# EasyEDA Pro project Macropad-Advanced.eprj

# Schematic Schematic1
Board Name: Board1; Create Date: 2025-08-17; Page Name: P1; Project Name: Macropad-Advanced; Schematic Name: Schematic1; Update Date: 2025-08-25; Company: EasyEDA.com; Page Size: A4; Version: V1.0
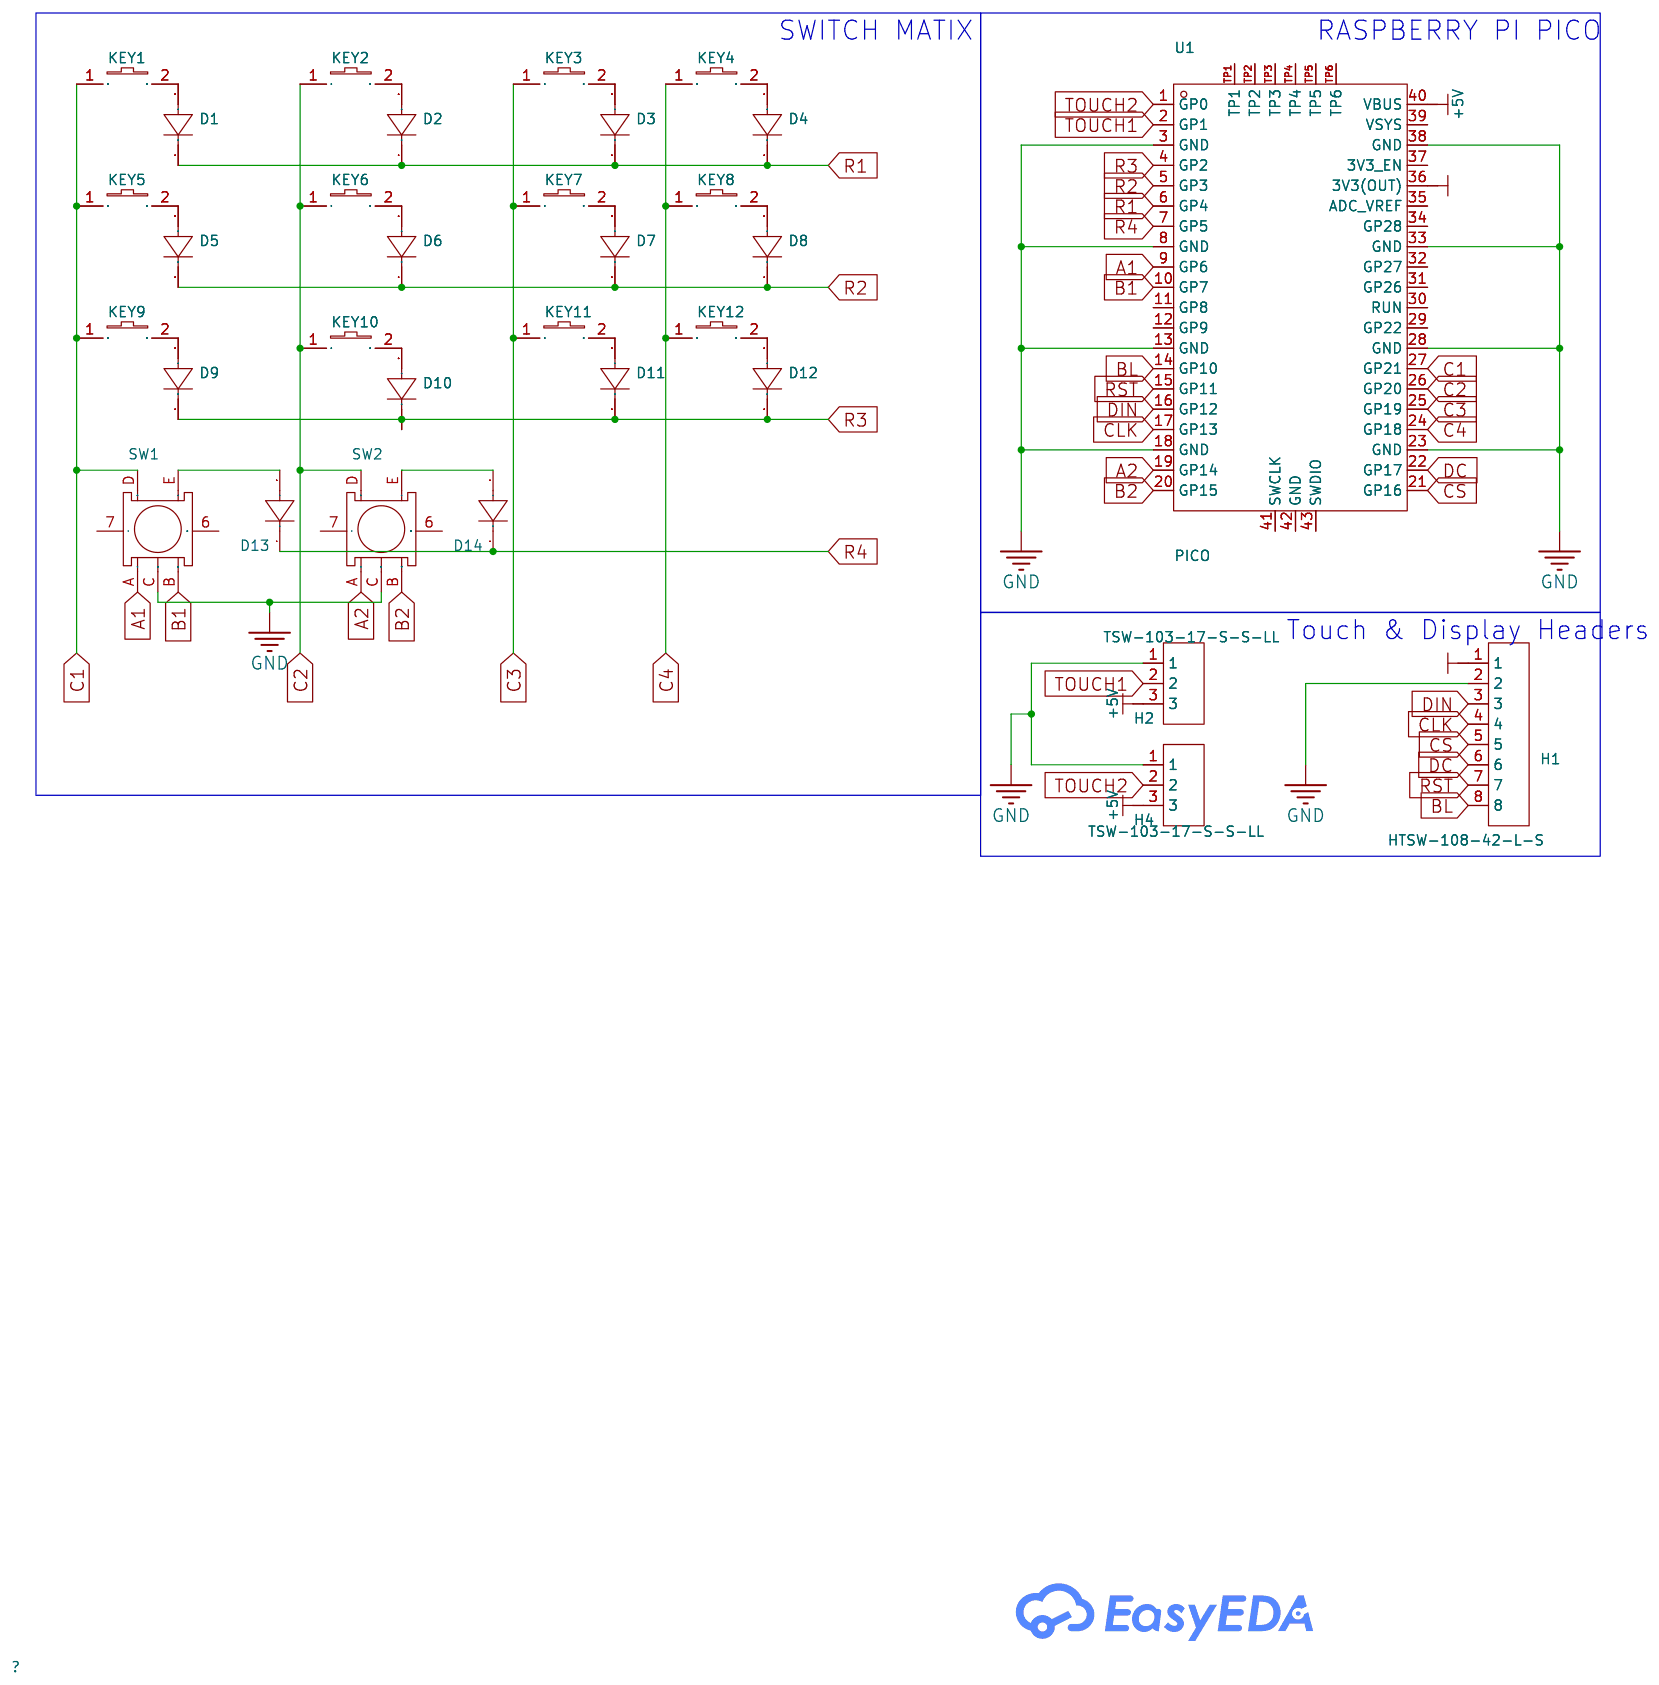
[diagram p0: schematic sheet]

## Parts
D1  -  [DO-35_BD2.0-L4.0-P8.00-D0.5-FD]
D2  -  [DO-35_BD2.0-L4.0-P8.00-D0.5-FD]
D3  -  [DO-35_BD2.0-L4.0-P8.00-D0.5-FD]
D4  -  [DO-35_BD2.0-L4.0-P8.00-D0.5-FD]
D5  -  [DO-35_BD2.0-L4.0-P8.00-D0.5-FD]
D6  -  [DO-35_BD2.0-L4.0-P8.00-D0.5-FD]
D7  -  [DO-35_BD2.0-L4.0-P8.00-D0.5-FD]
D8  -  [DO-35_BD2.0-L4.0-P8.00-D0.5-FD]
D9  -  [DO-35_BD2.0-L4.0-P8.00-D0.5-FD]
D10  -  [DO-35_BD2.0-L4.0-P8.00-D0.5-FD]
D11  -  [DO-35_BD2.0-L4.0-P8.00-D0.5-FD]
D12  -  [DO-35_BD2.0-L4.0-P8.00-D0.5-FD]
D13  -  [DO-35_BD2.0-L4.0-P8.00-D0.5-FD]
D14  -  [DO-35_BD2.0-L4.0-P8.00-D0.5-FD]
H1  HTSW-108-42-L-S  [HDR-TH_8P-P2.54-V-M]
H2  TSW-103-17-S-S-LL  [HDR-TH_3P-P2.54-V-M_HTSW-103-07-F-S]
H4  TSW-103-17-S-S-LL  [HDR-TH_3P-P2.54-V-M_HTSW-103-07-F-S]
KEY1  28115182DM  [MX_PCB_1.00u]
KEY2  28115182DM  [MX_PCB_1.00u]
KEY3  28115182DM  [MX_PCB_1.00u]
KEY4  28115182DM  [MX_PCB_1.00u]
KEY5  28115182DM  [MX_PCB_1.00u]
KEY6  28115182DM  [MX_PCB_1.00u]
KEY7  28115182DM  [MX_PCB_1.00u]
KEY8  28115182DM  [MX_PCB_1.00u]
KEY9  28115182DM  [MX_PCB_1.00u]
KEY10  28115182DM  [MX_PCB_1.00u]
KEY11  28115182DM  [MX_PCB_1.00u]
KEY12  28115182DM  [MX_PCB_1.00u]
SW1  EC11E09244BS  [SW-TH_EC11XXXXXXXX]
SW2  EC11E09244BS  [SW-TH_EC11XXXXXXXX]
U1  PICO  [Raspberry_Pi_Pico]

## Library data of the parts
D1-D14 = 1N4148: Diode Configuration: Power Dissipation: Reverse Voltage (Vr): Average Rectified Current (Io): Forward Voltage (Vf@If):1V@10mA Reverse Leakage Current:5μA@75V Reverse Recovery Time (trr): Operating Temperature:+200℃@(Tj) Operating Temperature:+200℃@(Tj); LCSC Part Name: 75V 200mA 4ns; Supplier Part: C14516; Manufacturer: ST(先科); Supplier Footprint: DO-35; JLCPCB Part Class: Extended Part; Datasheet: https://atta.szlcsc.com/upload/public/pdf/source/20140303/1457707004955.pdf; Supplier: LCSC; Forward Voltage (Vf@If): 1V@10mA; Reverse Leakage Current: 5μA@75V; Operating Temperature: +200℃@(Tj)
H1 = HTSW-108-42-L-S: LCSC Part Name: 间距:2.54mm 直插; Supplier Part: C6055184; Manufacturer: SAMTEC; Supplier Footprint: 插件,P=2.54mm; JLCPCB Part Class: Extended Part; Datasheet: https://item.szlcsc.com/datasheet/HTSW-108-42-L-S/6994319.html; Supplier: LCSC; Pitch: 2.54mm; Mounting Type: Through Hole; Number of Rows: 1; Number of Pins: 8P; Contact Material: Phosphor Bronze; Contact Plating: Tin; Operating Temperature: -55℃~+125℃
H2 H4 = TSW-103-17-S-S-LL: LCSC Part Name: 间距:2.54mm 直插; Supplier Part: C6339710; Manufacturer: SAMTEC; Supplier Footprint: 插件,P=2.54mm; JLCPCB Part Class: Extended Part; Datasheet: https://item.szlcsc.com/datasheet/TSW-103-17-S-S-LL/7288409.html; Supplier: LCSC; Pitch: 2.54mm; Mounting Type: Through Hole; Number of Rows: 1; Number of Pins: 3P; Contact Material: Phosphor Bronze; Contact Plating: Tin; Operating Temperature: -55℃~+125℃; Color: Black
KEY1-KEY12 = 28115182DM: Axis Type:水晶轴 Number of Pins:2 Life:5000万次 Operation Force:60gf Conduction Travel:- Voltage Rating:- Operating Temperature:-10℃~+70℃ Operating Temperature:-10℃~+70℃; Supplier Part: C47121945; Manufacturer: SAMZO(三佐); Supplier Footprint: 插件; JLCPCB Part Class: Extended Part; Datasheet: https://atta.szlcsc.com/upload/public/pdf/source/20250402/8399631E7C857A557AEE3DBE24222DC8.pdf; Supplier: LCSC; Axis Type: 水晶轴; Number of Pins: 2; Life: 5000万次; Operation Force: 60gf; Operating Temperature: -10℃~+70℃
SW1 SW2 = EC11E09244BS: Supplier Part: C470742; Manufacturer: ALPSALPINE(阿尔卑斯阿尔派); Supplier Footprint: 插件; JLCPCB Part Class: Extended Part; Datasheet: https://atta.szlcsc.com/upload/public/pdf/source/20191216/C470795_DE763ECE59BD49533DB26DB53E5D34B2.pdf; Supplier: LCSC
U1 = PICO: Supplier Part: C7203002; Manufacturer: Raspberry Pi(树莓派); Datasheet: https://atta.szlcsc.com/upload/public/pdf/source/20230906/086376002DDC9866828648BC93E51F8B.pdf; Supplier: LCSC

## Nets
3V3: H1.1 U1.36(3V3(OUT))
+5V: H2.3 H4.3 U1.40(VBUS)
GND: H1.2 H2.1 H4.1 SW1.C SW2.C U1.3(GND) U1.8(GND) U1.13(GND) U1.18(GND) U1.23(GND) U1.28(GND) U1.33(GND) U1.38(GND)
A1: SW1.A U1.9(GP6)
A2: SW2.A U1.19(GP14)
B1: SW1.B U1.10(GP7)
B2: SW2.B U1.20(GP15)
BL: H1.8 U1.14(GP10)
C1: KEY1.1 KEY5.1 KEY9.1 SW1.D U1.27(GP21)
C2: KEY2.1 KEY6.1 KEY10.1 SW2.D U1.26(GP20)
C3: KEY3.1 KEY7.1 KEY11.1 U1.25(GP19)
C4: KEY4.1 KEY8.1 KEY12.1 U1.24(GP18)
CLK: H1.4 U1.17(GP13)
CS: H1.5 U1.21(GP16)
DC: H1.6 U1.22(GP17)
DIN: H1.3 U1.16(GP12)
R1: D1.1(K) D2.1(K) D3.1(K) D4.1(K) U1.6(GP4)
R2: D5.1(K) D6.1(K) D7.1(K) D8.1(K) U1.5(GP3)
R3: D9.1(K) D10.1(K) D11.1(K) D12.1(K) U1.4(GP2)
R4: D13.1(K) D14.1(K) U1.7(GP5)
RST: H1.7 U1.15(GP11)
TOUCH1: H2.2 U1.2(GP1)
TOUCH2: H4.2 U1.1(GP0)
$1N1027: D3.2(A) KEY3.2
$1N4546: D4.2(A) KEY4.2
$1N4608: D5.2(A) KEY5.2
$1N4671: D6.2(A) KEY6.2
$1N4735: D7.2(A) KEY7.2
$1N4798: D8.2(A) KEY8.2
$1N4860: D9.2(A) KEY9.2
$1N5043: D10.2(A) KEY10.2
$1N5045: D11.2(A) KEY11.2
$1N5047: D12.2(A) KEY12.2
$1N9257: D2.2(A) KEY2.2
$1N9289: D13.2(A) SW1.E
$1N9294: D14.2(A) SW2.E
$1N13677: D1.2(A) KEY1.2

Not connected (* = marked no-connect by the designer): SW1 6 7; SW2 6 7; U1 11(GP8) 12(GP9) 29(GP22) 30(RUN) 31(GP26) 32(GP27) 34(GP28) 35(ADC_VREF) 37(3V3_EN) 39(VSYS) 41(SWCLK) 42(GND) 43(SWDIO) TP1 TP2 TP3 TP4 TP5 TP6

## Notes on the sheet
- SWITCH MATIX
- RASPBERRY PI PICO
- Touch & Display Headers

# Board PCB1
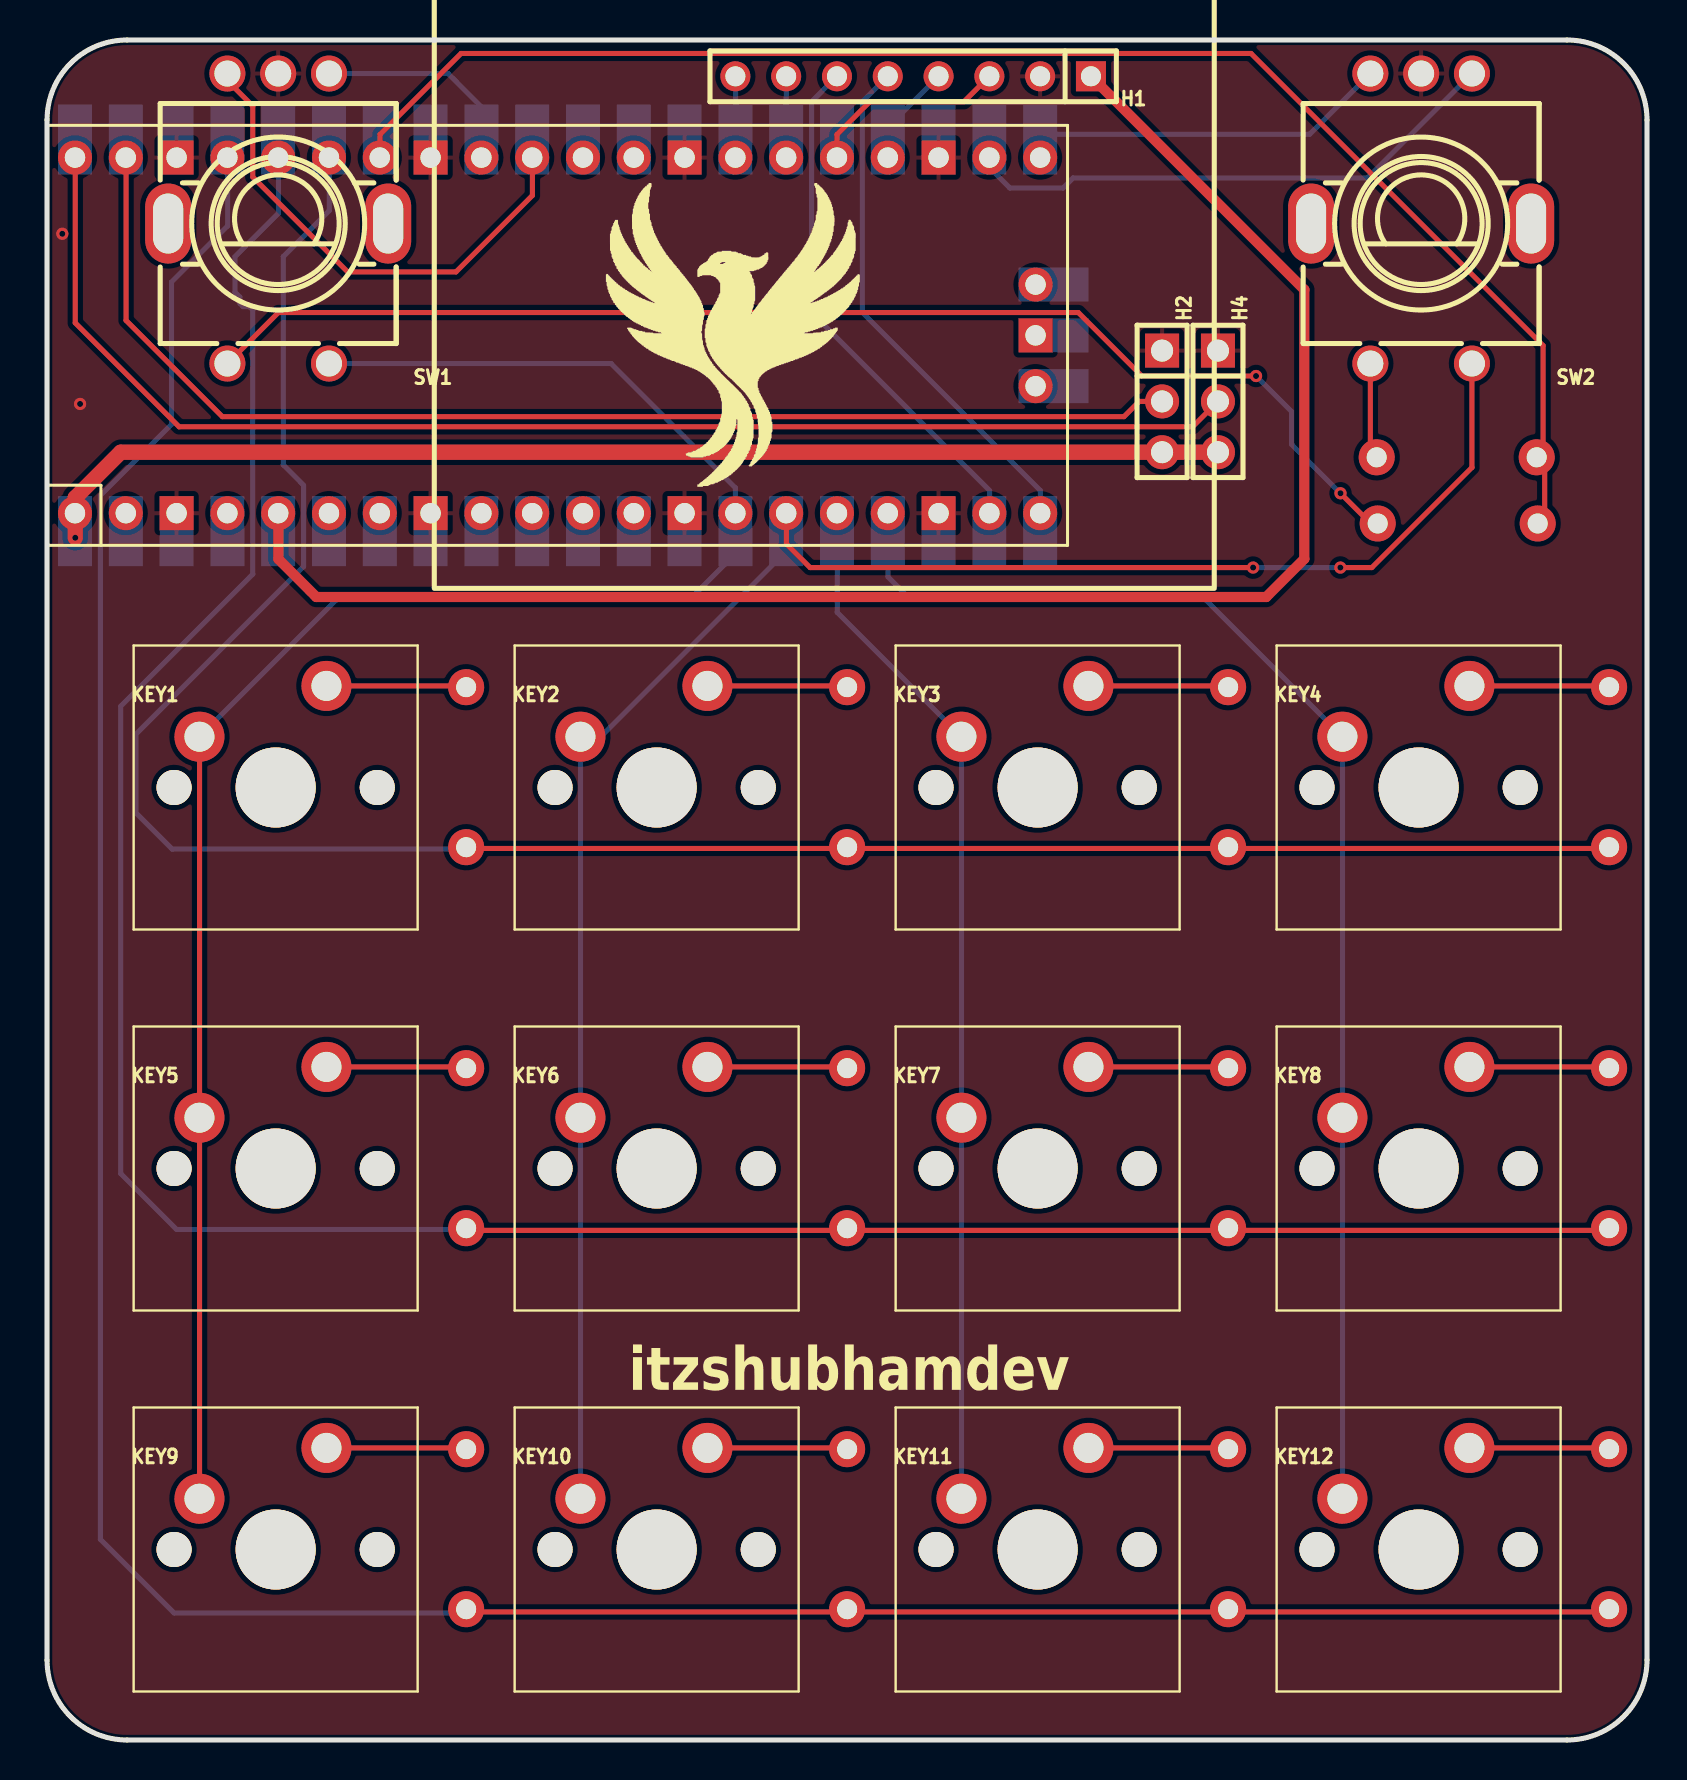
[diagram p1: board, top side]
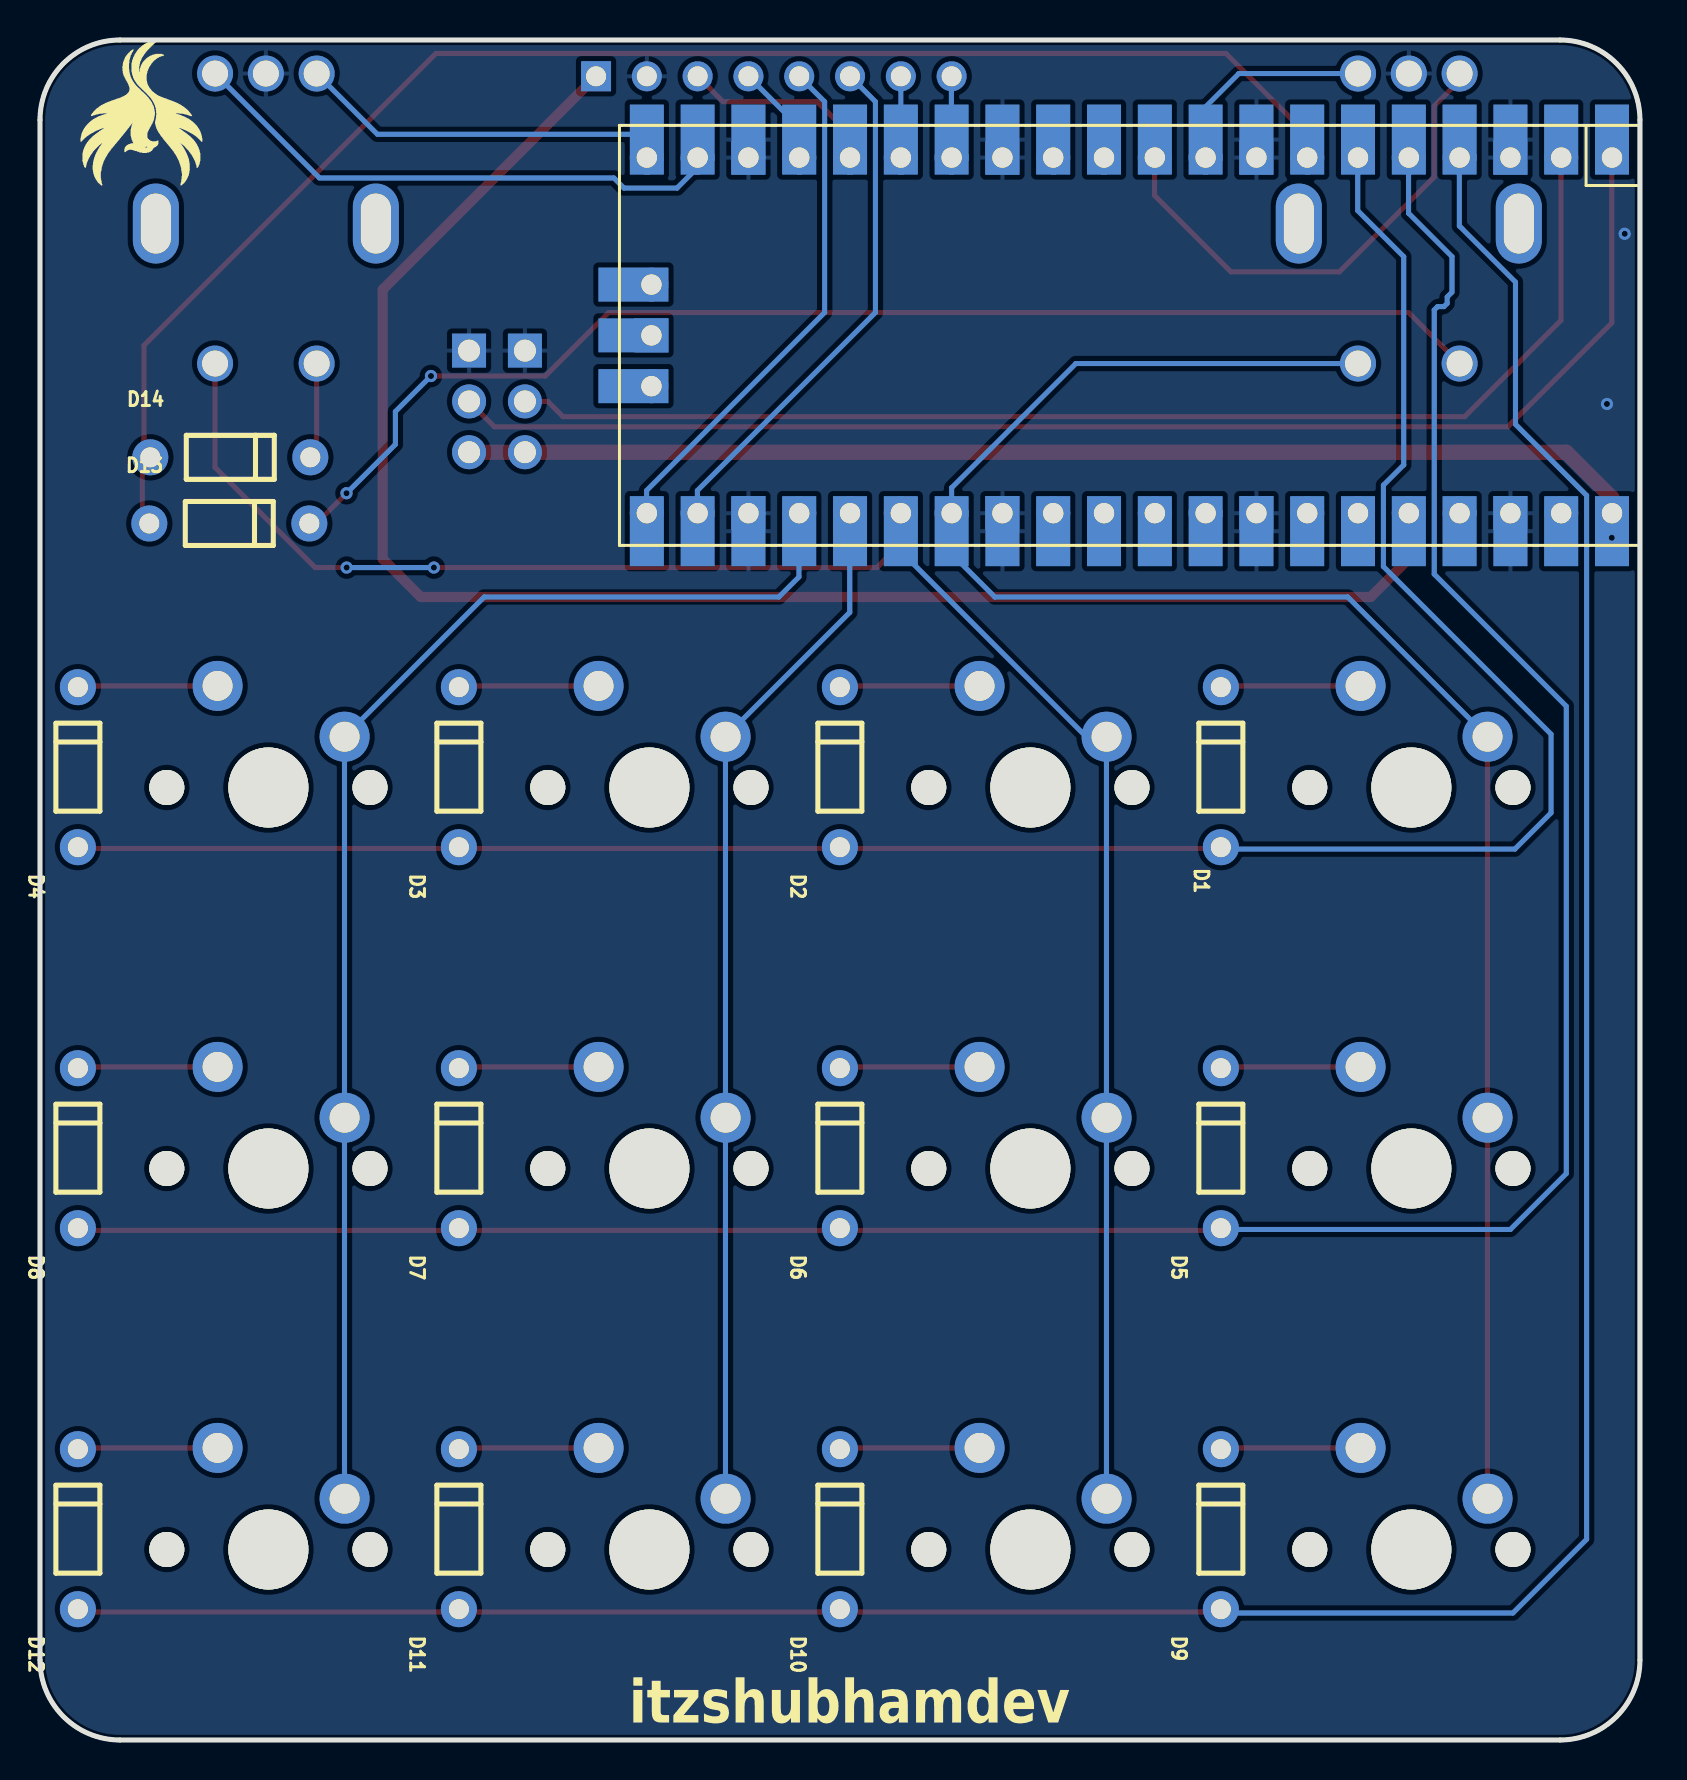
[diagram p2: board, bottom side, seen from below]

Outline 80 x 85 mm; copper layers: Top Layer, Bottom Layer. Coordinates in mm from the lower left corner of the outline.
Outline path: 0,81 0,4 arc(1.17,1.17) 4,0 76,0 arc(78.83,1.17) 80,4 80,81 arc(78.83,83.83) 76,85 4,85 arc(1.17,83.83) 0,81
Stack: Top Layer 0.035mm / Dielectric1 1.51mm FR4 er 4.5 / Bottom Layer 0.035mm

## Design rules (mm)
template: JLCPCB Capability(Two Layers Board)
spacing copperThickness1oz (default): track to track 0.102, other pairs 0.152 to 0.3
spacing copperThickness2oz: track to track 0.203, other pairs 0.152 to 0.3
track width copperThickness1oz (default): min 0.127, default 0.254, max 2.54
track width copperThickness2oz: min 0.203, default 0.254, max 2.54
differential pair differentialPair (default): width min 0.127, default 0.254, max 2.54; gap min 0.152, default 0.152
via viaSize (default): diameter min 0.5, default 0.61, max 10; hole min 0.3, default 0.305, max 6.3

## Placement (name value [footprint] x y rotation side)
D1  -  [DO-35_BD2.0-L4.0-P8.00-D0.5-FD]  20.95 48.64 90 bottom
D2  -  [DO-35_BD2.0-L4.0-P8.00-D0.5-FD]  40 48.64 90 bottom
D3  -  [DO-35_BD2.0-L4.0-P8.00-D0.5-FD]  59.06 48.64 90 bottom
D4  -  [DO-35_BD2.0-L4.0-P8.00-D0.5-FD]  78.1 48.64 90 bottom
D5  -  [DO-35_BD2.0-L4.0-P8.00-D0.5-FD]  20.95 29.59 90 bottom
D6  -  [DO-35_BD2.0-L4.0-P8.00-D0.5-FD]  40 29.59 90 bottom
D7  -  [DO-35_BD2.0-L4.0-P8.00-D0.5-FD]  59.06 29.59 90 bottom
D8  -  [DO-35_BD2.0-L4.0-P8.00-D0.5-FD]  78.1 29.59 90 bottom
D9  -  [DO-35_BD2.0-L4.0-P8.00-D0.5-FD]  20.95 10.54 90 bottom
D10  -  [DO-35_BD2.0-L4.0-P8.00-D0.5-FD]  40 10.54 90 bottom
D11  -  [DO-35_BD2.0-L4.0-P8.00-D0.5-FD]  59.06 10.54 90 bottom
D12  -  [DO-35_BD2.0-L4.0-P8.00-D0.5-FD]  78.1 10.54 90 bottom
D13  -  [DO-35_BD2.0-L4.0-P8.00-D0.5-FD]  70.53 60.83 180 bottom
D14  -  [DO-35_BD2.0-L4.0-P8.00-D0.5-FD]  70.48 64.14 180 bottom
H1  HTSW-108-42-L-S  [HDR-TH_8P-P2.54-V-M]  43.31 83.19 180 top
H2  TSW-103-17-S-S-LL  [HDR-TH_3P-P2.54-V-M_HTSW-103-07-F-S]  55.75 66.93 270 top
H4  TSW-103-17-S-S-LL  [HDR-TH_3P-P2.54-V-M_HTSW-103-07-F-S]  58.55 66.93 270 top
KEY1  28115182DM  [MX_PCB_1.00u]  11.43 47.63 0 top
KEY2  28115182DM  [MX_PCB_1.00u]  30.48 47.63 0 top
KEY3  28115182DM  [MX_PCB_1.00u]  49.53 47.63 0 top
KEY4  28115182DM  [MX_PCB_1.00u]  68.58 47.63 0 top
KEY5  28115182DM  [MX_PCB_1.00u]  11.43 28.58 0 top
KEY6  28115182DM  [MX_PCB_1.00u]  30.48 28.58 0 top
KEY7  28115182DM  [MX_PCB_1.00u]  49.53 28.58 0 top
KEY8  28115182DM  [MX_PCB_1.00u]  68.58 28.58 0 top
KEY9  28115182DM  [MX_PCB_1.00u]  11.43 9.53 0 top
KEY10  28115182DM  [MX_PCB_1.00u]  30.48 9.53 0 top
KEY11  28115182DM  [MX_PCB_1.00u]  49.53 9.53 0 top
KEY12  28115182DM  [MX_PCB_1.00u]  68.58 9.53 0 top
SW1  EC11E09244BS  [SW-TH_EC11XXXXXXXX]  11.56 76.07 180 top
SW2  EC11E09244BS  [SW-TH_EC11XXXXXXXX]  68.71 76.07 180 top
U1  PICO  [Raspberry_Pi_Pico]  25.53 70.23 270 bottom

## Footprints (pads in the part's own frame, mm; a bottom-side part is the same pattern mirrored in y, then rotated)
DO-35_BD2.0-L4.0-P8.00-D0.5-FD
  round 1.801 hole 1.001: 1(-4,0) 2(4,0)
HDR-TH_3P-P2.54-V-M_HTSW-103-07-F-S
  rect 1.7x1.7 hole 1.1: 1(-2.54,0)
  round 1.7 hole 1.1: 2(0,0) 3(2.54,0)
HDR-TH_8P-P2.54-V-M
  rect 1.5x1.5 hole 1: 1(-8.89,0)
  round 1.5 hole 1: 2(-6.35,0) 3(-3.81,0) 4(-1.27,0) 5(1.27,0) 6(3.81,0) 7(6.35,0) 8(8.89,0)
MX_PCB_1.00u
  round 1.75 hole 1.75: (-5.08,0) (5.08,0)
  round 4 hole 4: (0,0)
  round 2.5 hole 1.5: 1(-3.81,2.54) 2(2.54,5.08)
Raspberry_Pi_Pico
  rect 3.5x1.7 smd: 1(-9.79,24.13) 2(-9.79,21.59) 3(-9.79,19.05) 4(-9.79,16.51) 5(-9.79,13.97) 6(-9.79,11.43) 7(-9.79,8.89) 8(-9.79,6.35) 9(-9.79,3.81) 10(-9.79,1.27) 11(-9.79,-1.27) 12(-9.79,-3.81) 13(-9.79,-6.35) 14(-9.79,-8.89) 15(-9.79,-11.43) 16(-9.79,-13.97) 17(-9.79,-16.51) 18(-9.79,-19.05) 19(-9.79,-21.59) 20(-9.79,-24.13) 21(9.79,-24.13) 22(9.79,-21.59) 23(9.79,-19.05) 24(9.79,-16.51) 25(9.79,-13.97) 26(9.79,-11.43) 27(9.79,-8.89) 28(9.79,-6.35) 29(9.79,-3.81) 30(9.79,-1.27) 31(9.79,1.27) 32(9.79,3.81) 33(9.79,6.35) 34(9.79,8.89) 35(9.79,11.43) 36(9.79,13.97) 37(9.79,16.51) 38(9.79,19.05) 39(9.79,21.59) 40(9.79,24.13)
  round 1.7 hole 1.02: 1(-8.89,24.13) 2(-8.89,21.59) 4(-8.89,16.51) 5(-8.89,13.97) 6(-8.89,11.43) 7(-8.89,8.89) 9(-8.89,3.81) 10(-8.89,1.27) 11(-8.89,-1.27) 12(-8.89,-3.81) 14(-8.89,-8.89) 15(-8.89,-11.43) 16(-8.89,-13.97) 17(-8.89,-16.51) 19(-8.89,-21.59) 20(-8.89,-24.13) 21(8.89,-24.13) 22(8.89,-21.59) 24(8.89,-16.51) 25(8.89,-13.97) 26(8.89,-11.43) 27(8.89,-8.89) 29(8.89,-3.81) 30(8.89,-1.27) 31(8.89,1.27) 32(8.89,3.81) 34(8.89,8.89) 35(8.89,11.43) 36(8.89,13.97) 37(8.89,16.51) 39(8.89,21.59) 40(8.89,24.13) 41(-2.54,-23.9) 43(2.54,-23.9)
  rect 1.7x1.7 hole 1.02: 3(-8.89,19.05) 8(-8.89,6.35) 13(-8.89,-6.35) 18(-8.89,-19.05) 23(8.89,-19.05) 28(8.89,-6.35) 33(8.89,6.35) 38(8.89,19.05) 42(0,-23.9)
  rect 1.7x3.5 smd: 41(-2.54,-24.8) 42(0,-24.8) 43(2.54,-24.8)
SW-TH_EC11XXXXXXXX
  oval 2.3x4 hole 1.5x3: 6(5.5,0.25) 7(-5.5,0.25)
  round 1.8 hole 1.3: A(-2.54,-7.25) B(2.54,-7.25) C(0,-7.25) D(-2.54,7.25) E(2.54,7.25)

## Nets
As in the schematic.

Pads without a net: SW1 6 7; SW2 6 7; U1 11 12 29 30 31 32 34 35 37 39 41 42 43

## Via types
v1: diameter 0.61, hole 0.305, Top Layer to Bottom Layer, 7 vias

## Routing (per net, layer and track width the routed paths; a pad name or vN(x,y) marks a point on that pad's centre or on a via; arc(x,y) is an arc through that point)
3V3: length 83
  Top Layer w0.508: H1.1 62.87,72.52 62.87,59.06 60.96,57.15 13.46,57.15 11.57,59.04 11.57,60.61
+5V: length 60.1
  Top Layer w0.762: v1(1.41,60.11) 1.41,62.12 3.68,64.39 H2.3 H4.3
GND:
  vias: v1(0.76,75.31) v1(1.65,66.8)
A1: length 9.7
  Bottom Layer w0.254: 21.73,80.29 21.72,80.3 21.72,81.66 20.06,83.32 SW1.A
A2: length 28.6
  Bottom Layer w0.254: 47.13,80.29 47.13,78.61 48.15,77.6 50.8,77.6 51.31,78.1 66.03,78.1 SW2.A
B1: length 25.4
  Top Layer w0.254: 24.27,79.79 24.27,77.23 20.45,73.41 15.03,73.41 10.29,78.15 10.29,81.7 9.23,82.76 9.14,82.76 9.02,82.88
B2: length 17.8
  Bottom Layer w0.254: SW2.B 63.13,80.29 49.67,80.29
BL: length 2.9
  Bottom Layer w0.254: H1.8 34.43,83.17 34.43,80.29
C1: length 94.9
  Top Layer w0.254: 7.62,50.17 7.62,12.07
  Bottom Layer w0.254: 7.62,50.17 14.61,57.15 32.26,57.15 34.43,59.32 34.43,60.11 34.42,60.12 U1.27 34.42,62.61 28.2,68.82 SW1.D
C2: length 95.7
  Top Layer w0.254: 36.97,60.61 36.97,59.8 38.15,58.62 v1(60.3,58.62) ; SW2.D 71.25,63.63 66.24,58.62 v1(64.67,58.62)
  Bottom Layer w0.254: v1(60.3,58.62) v1(64.67,58.62) ; 26.67,12.07 26.67,50.17 27.69,50.17 36.97,59.45 36.97,60.11
C3: length 50.6
  Bottom Layer w0.254: 45.72,12.07 45.72,50.17 39.51,56.38 39.51,60.11
C4: length 66.1
  Bottom Layer w0.254: 42.05,60.11 42.05,58.15 43.05,57.15 57.79,57.15 64.78,50.17 64.78,12.07
CLK: length 3.9
  Bottom Layer w0.254: 42.05,80.29 42.05,80.66 H1.4
CS: length 27.3
  Bottom Layer w0.254: H1.5 40.77,81.92 40.77,71.37 49.67,62.47 49.67,60.11
DC: length 27.3
  Bottom Layer w0.254: H1.6 38.23,81.92 38.23,71.37 47.13,62.47 47.13,60.11
DIN: length 10
  Top Layer w0.254: H1.3 45.85,81.92 41.14,81.92 39.5,80.27 U1.16
R1: length 113.4
  Top Layer w0.254: 20.95,44.58 77.56,44.58 78.1,44.04
  Bottom Layer w0.254: 20.95,44.55 6.25,44.55 4.44,46.36 4.44,50.29 12.83,58.67 12.83,62.74 11.81,63.75 11.81,74.17 14.11,76.47 14.11,80.29
R2: length 131.6
  Top Layer w0.254: 78.1,25.48 21.06,25.48
  Bottom Layer w0.254: 11.57,80.29 11.57,76.34 9.4,74.17 9.4,72.39 9.64,72.15 9.64,71.83 9.8,71.67 10.12,71.67 10.29,71.5 10.29,58.29 3.68,51.69 3.68,28.32 6.48,25.53 20.92,25.53
R3: length 150
  Top Layer w0.254: 78.1,5.94 77.64,6.4 20.95,6.4
  Bottom Layer w0.254: 9.03,80.29 9.03,75.7 6.22,72.9 6.22,65.79 2.67,62.23 2.67,10.03 6.35,6.35 20.95,6.35
R4: length 75.3
  Top Layer w0.254: 74.88,60.83 74.88,64.09 74.8,64.17 74.8,69.72 60.2,84.33 20.7,84.33 16.65,80.28 16.65,79.79
RST: length 2.9
  Bottom Layer w0.254: H1.7 36.96,80.3 36.97,80.29
TOUCH1: length 62.9
  Top Layer w0.254: H2.2 54.61,66.93 53.85,66.17 8.76,66.17 3.95,70.98 3.95,79.79
TOUCH2: length 68.7
  Top Layer w0.254: 1.41,79.79 1.41,70.85 6.6,65.66 57.28,65.66 H4.2
$1N1027: length 7
  Top Layer w0.254: 59.06,52.74 59.02,52.71 52.06,52.71
$1N4546: length 7
  Top Layer w0.254: 71.12,52.71 78.07,52.71 78.1,52.74
$1N4608: length 7
  Top Layer w0.254: 20.95,33.69 20.92,33.66 13.96,33.66
$1N4671: length 7
  Top Layer w0.254: 40,33.69 39.97,33.66 33.01,33.66
$1N4735: length 7
  Top Layer w0.254: 52.06,33.66 59.02,33.66 59.06,33.69
$1N4798: length 7
  Top Layer w0.254: 71.12,33.66 78.07,33.66 78.1,33.69
$1N4860: length 7
  Top Layer w0.254: 13.96,14.61 20.92,14.61 20.95,14.64
$1N5043: length 7
  Top Layer w0.254: 33.01,14.61 39.97,14.61 40,14.64
$1N5045: length 7
  Top Layer w0.254: 52.06,14.61 59.02,14.61 59.06,14.64
$1N5047: length 7
  Top Layer w0.254: 71.12,14.61 78.07,14.61 78.1,14.64
$1N9257: length 7
  Top Layer w0.254: 33.01,52.71 39.97,52.71 40,52.74
$1N9289: length 63.6
  Top Layer w0.254: SW1.E 11.57,71.37 51.56,71.37 54.74,68.2 v1(60.45,68.2) ; v1(64.67,62.34) 66.19,60.83
  Bottom Layer w0.254: v1(60.45,68.2) 62.23,66.42 62.23,64.78 v1(64.67,62.34)
$1N9294: length 4.7
  Top Layer w0.254: 66.13,64.14 66.17,64.17 SW2.E
$1N13677: length 7
  Top Layer w0.254: 20.95,52.74 20.92,52.71 13.96,52.71

## Copper pours and planes (outline as drawn; the poured copper is in the pictures)
GND on Top Layer: 0,85 80,85 80,0 0,0
GND on Bottom Layer: 0,85 80,85 80,0 0,0

## Text on the board
Bottom Silkscreen Layer: itzshubhamdev
Top Silkscreen Layer: itzshubhamdev
